# Altium schematic sheet Mother_board1.SchDoc
size A4
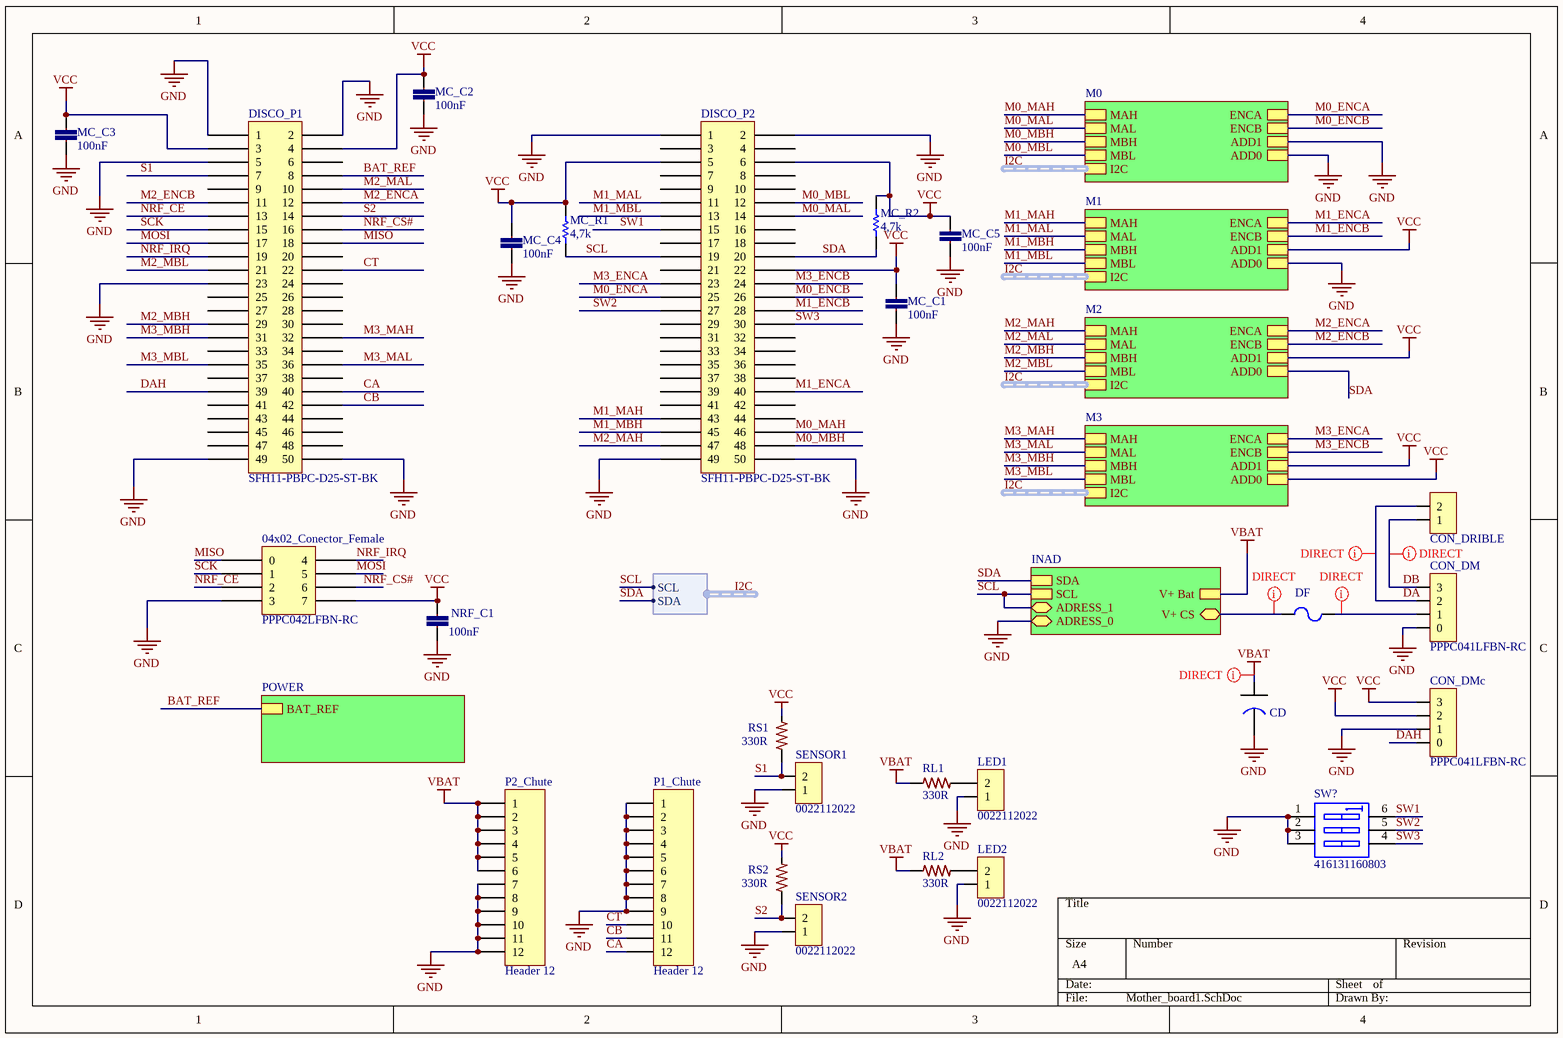
[diagram p0: Mother_board1.SchDoc]

## Parts
04x02_Conector_Female  PPPC042LFBN-RC  [04x02_Conector_Female]
CD  EEE-FK1C681GP  [EEE-FK1C681GP]  (value not drawn)
CON_DM  PPPC041LFBN-RC  [04x01_Conector_Female - duplicate]
CON_DMc  PPPC041LFBN-RC  [04x01_Conector_Female - duplicate]
CON_DRIBLE  0022112022  [02x01_Conector_Male]  (value not drawn)
DF  MF-MSMF250/16X  [RESC4632X16N]  (value not drawn)
DISCO_P1  SFH11-PBPC-D25-ST-BK  [25x02_Conector_Female]
DISCO_P2  SFH11-PBPC-D25-ST-BK  [25x02_Conector_Female]
LED1  0022112022  [02x01_Conector_Male]
LED2  0022112022  [02x01_Conector_Male]
MC_C1  100nF  [0402-CAP]
MC_C2  100nF  [0402-CAP]
MC_C3  100nF  [0402-CAP]
MC_C4  100nF  [0402-CAP]
MC_C5  100nF  [0402-CAP]
MC_R1  4,7k  [0402]
MC_R2  4,7k  [0402]
NRF_C1  100nF  [0402-CAP]
P1_Chute  Header 12  [HDR1X12]
P2_Chute  Header 12  [HDR1X12]
RL1  330R  [0402-RES-HD]
RL2  330R  [0402-RES-HD]
RS1  330R  [0402-RES-HD]
RS2  330R  [0402-RES-HD]
SENSOR1  0022112022  [02x01_Conector_Male]
SENSOR2  0022112022  [02x01_Conector_Male]
SW?  416131160803  [416131160803]

## Sub-sheets
INAD = INA220.SchDoc: V+ Bat, SDA, SCL, ADRESS_1, ADRESS_0, V+ CS
M0 = MOTORES.SchDoc: MBH, MAH, MBL, MAL, I2C (harness I2C), ENCA, ENCB, ADD1, ADD0
M1 = MOTORES.SchDoc: MBH, MAH, MBL, MAL, I2C (harness I2C), ENCA, ENCB, ADD1, ADD0
M2 = MOTORES.SchDoc: MBH, MAH, MBL, MAL, I2C (harness I2C), ENCA, ENCB, ADD1, ADD0
M3 = MOTORES.SchDoc: MBH, MAH, MBL, MAL, I2C (harness I2C), ENCA, ENCB, ADD1, ADD0
POWER = POWER.SchDoc: BAT_REF

## Harnesses
I2C: SCL, SDA

## Nets
GND: 04x02_Conector_Female.3 CD.2 CON_DM.0 CON_DMc.1 DISCO_P1.1 DISCO_P1.2 DISCO_P1.5 DISCO_P1.23 DISCO_P1.49 DISCO_P1.50 DISCO_P2.1 DISCO_P2.2 DISCO_P2.49 DISCO_P2.50 LED1.1 LED2.1 MC_C1.1 MC_C2.1 MC_C3.2 MC_C4.1 MC_C5.1 NRF_C1.2 P1_Chute.1 P1_Chute.2 P1_Chute.3 P1_Chute.4 P1_Chute.5 P1_Chute.6 P1_Chute.7 P1_Chute.8 P1_Chute.9 P2_Chute.7 P2_Chute.8 P2_Chute.9 P2_Chute.10 P2_Chute.11 P2_Chute.12 SENSOR1.1 SENSOR2.1 SW?.1 SW?.2 SW?.3 ; sheet M0/ADD1, sheet M0/ADD0, sheet M1/ADD0, sheet INAD/ADRESS_0
VBAT: CD.1 P2_Chute.1 P2_Chute.2 P2_Chute.3 P2_Chute.4 P2_Chute.5 P2_Chute.6 RL1.1 RL2.1 ; sheet INAD/V+ Bat
VCC: 04x02_Conector_Female.7 CON_DMc.2 CON_DMc.3 DISCO_P1.3 DISCO_P1.4 DISCO_P2.5 DISCO_P2.6 DISCO_P2.22 MC_C1.2 MC_C2.2 MC_C3.1 MC_C4.2 MC_C5.2 MC_R1.2 MC_R2.2 NRF_C1.1 RS1.2 RS2.2 ; sheet M1/ADD1, sheet M2/ADD1, sheet M3/ADD1, sheet M3/ADD0
BAT_REF: DISCO_P1.8 ; sheet POWER/BAT_REF
CA: DISCO_P1.40 P1_Chute.12
CB: DISCO_P1.42 P1_Chute.11
CT: DISCO_P1.22 P1_Chute.10
DA: CON_DM.2 CON_DRIBLE.2
DAH: CON_DMc.0 DISCO_P1.39
DB: CON_DM.3 CON_DRIBLE.1
M0_ENCA: DISCO_P2.25 ; sheet M0/ENCA
M0_ENCB: DISCO_P2.26 ; sheet M0/ENCB
M0_MAH: DISCO_P2.46 ; sheet M0/MAH
M0_MAL: DISCO_P2.14 ; sheet M0/MAL
M0_MBH: DISCO_P2.48 ; sheet M0/MBH
M0_MBL: DISCO_P2.12 ; sheet M0/MBL
M1_ENCA: DISCO_P2.40 ; sheet M1/ENCA
M1_ENCB: DISCO_P2.28 ; sheet M1/ENCB
M1_MAH: DISCO_P2.43 ; sheet M1/MAH
M1_MAL: DISCO_P2.11 ; sheet M1/MAL
M1_MBH: DISCO_P2.45 ; sheet M1/MBH
M1_MBL: DISCO_P2.13 ; sheet M1/MBL
M2_ENCA: DISCO_P1.12 ; sheet M2/ENCA
M2_ENCB: DISCO_P1.11 ; sheet M2/ENCB
M2_MAH: DISCO_P2.47 ; sheet M2/MAH
M2_MAL: DISCO_P1.10 ; sheet M2/MAL
M2_MBH: DISCO_P1.29 ; sheet M2/MBH
M2_MBL: DISCO_P1.21 ; sheet M2/MBL
M3_ENCA: DISCO_P2.23 ; sheet M3/ENCA
M3_ENCB: DISCO_P2.24 ; sheet M3/ENCB
M3_MAH: DISCO_P1.32 ; sheet M3/MAH
M3_MAL: DISCO_P1.36 ; sheet M3/MAL
M3_MBH: DISCO_P1.31 ; sheet M3/MBH
M3_MBL: DISCO_P1.35 ; sheet M3/MBL
MISO: 04x02_Conector_Female.0 DISCO_P1.18
MOSI: 04x02_Conector_Female.5 DISCO_P1.17
NRF_CE: 04x02_Conector_Female.2 DISCO_P1.13
NRF_CS#: 04x02_Conector_Female.6 DISCO_P1.16
NRF_IRQ: 04x02_Conector_Female.4 DISCO_P1.19
S1: DISCO_P1.7 RS1.1 SENSOR1.2
S2: DISCO_P1.14 RS2.1 SENSOR2.2
SCK: 04x02_Conector_Female.1 DISCO_P1.15
SCL: DISCO_P2.19 MC_R1.1 ; sheet INAD/SCL, sheet INAD/ADRESS_1, sheet M0/I2C.SCL  [project net I2C.SCL]
SDA: DISCO_P2.20 MC_R2.1 ; sheet M2/ADD0, sheet INAD/SDA, sheet M0/I2C.SDA  [project net I2C.SDA]
SW1: DISCO_P2.15 SW?.6
SW2: DISCO_P2.27 SW?.5
SW3: DISCO_P2.30 SW?.4
NetCON_DM_1: CON_DM.1 DF.1
NetDF_2: DF.2 ; sheet INAD/V+ CS
NetLED1_2: LED1.2 RL1.2
NetLED2_2: LED2.2 RL2.2

Not connected (* = marked no-connect by the designer): DISCO_P1 6 9 20 24 25 26 27 28 30 33 34 37 38 41 43 44 45 46 47 48; DISCO_P2 3 4 7 8 9 10 16 17 18 21 29 31 32 33 34 35 36 37 38 39 41 42 44

## Buses and harness runs
harness I2C = sheet M0/I2C
harness I2C = sheet M1/I2C
harness I2C = sheet M2/I2C
harness I2C = sheet M3/I2C

## Layout directives
net class DIRECT: DA, DB, NetCON_DM_1, NetDF_2, VBAT

## Library data of the parts
04x02_Conector_Female = 04x02_Conector_Female: 8 Position Header Connector 0.100" (2.54mm) Through Hole Gold
CD = CAP AL 680UF/16V: Aluminum Electrolytic Capacitors - SMD Al Lytic Cap SMT FK Series 105C
CON_DM CON_DMc = 04x01_Conector_Female-SCH: 4 Position Header Connector 0.100" (2.54mm) Through Hole Gold
CON_DRIBLE LED1 LED2 SENSOR1 SENSOR2 = 02x01_Conector_Male: CONN HEADER 2POS .100 VERT GOLD
DF = MF-MSMF250/16X-01.A.1: PTC RESETTABLE .30A 30V 1812
DISCO_P1 DISCO_P2 = 25x02_Conector_Female: 50 Position Header Connector 0.100" (2.54mm) Through Hole Gold
MC_C1-MC_C5 NRF_C1 = CC0402-100nF-A.12: CAP CER 0.1UF 10V 20% X5R 0402; Part No: VJ0402V104ZXQPBC; Cod EMS: 05.281.006.133; Value: 100n
MC_R1 MC_R2 = Res1: Resistor; Published: 8-Jun-2000; LatestRevisionDate: 17-Jul-2002; LatestRevisionNote: Re-released for DXP Platform.; PackageReference: AXIAL-0.3; Publisher: Altium Limited; PackageDescription: Axial Device, Thru-Hole; 2 Leads; 0.3 in Pin Spacing; Value: 4,7K
P1_Chute P2_Chute = Header 12: Header, 12-Pin; LatestRevisionDate: 17-Jul-2002; LatestRevisionNote: Re-released for DXP Platform.; Publisher: Altium Limited
RL1 RL2 RS1 RS2 = R0402-330R-7: RES 330 OHM 1/10W 1% 0402 SMD; Part No: ERJ-2RKF3300X; Value: 330; Cod EMS: 05.280.029.506; Family Description: RESISTOR FILME ESPESSO 10R-1M / 1/10W / 1% / 0402. P/N: ERJ-2RKF....X – PANASONIC ELECTRONIC COMPONENTS.; Family: ERJ-2RKF....X
SW? = CMP-1433-00003-1: WS-DISV 1.27 mm small compact SMD Dip Switch with top tape; Manufacturer: Wuerth Elektronik; NoPins: 06; ComponentLink2Description: Datasheet; ComponentLink1URL: http://www.we-online.com; PackageReference: 416131160803; ComponentLink1Description: Manufacturer URL; PartNumber: 416131160803; ComponentLink2URL: http://katalog.we-online.de/em/datasheet/4161311608xx.pdf